# Altium project Project Sunsat PCB new.PrjPcb
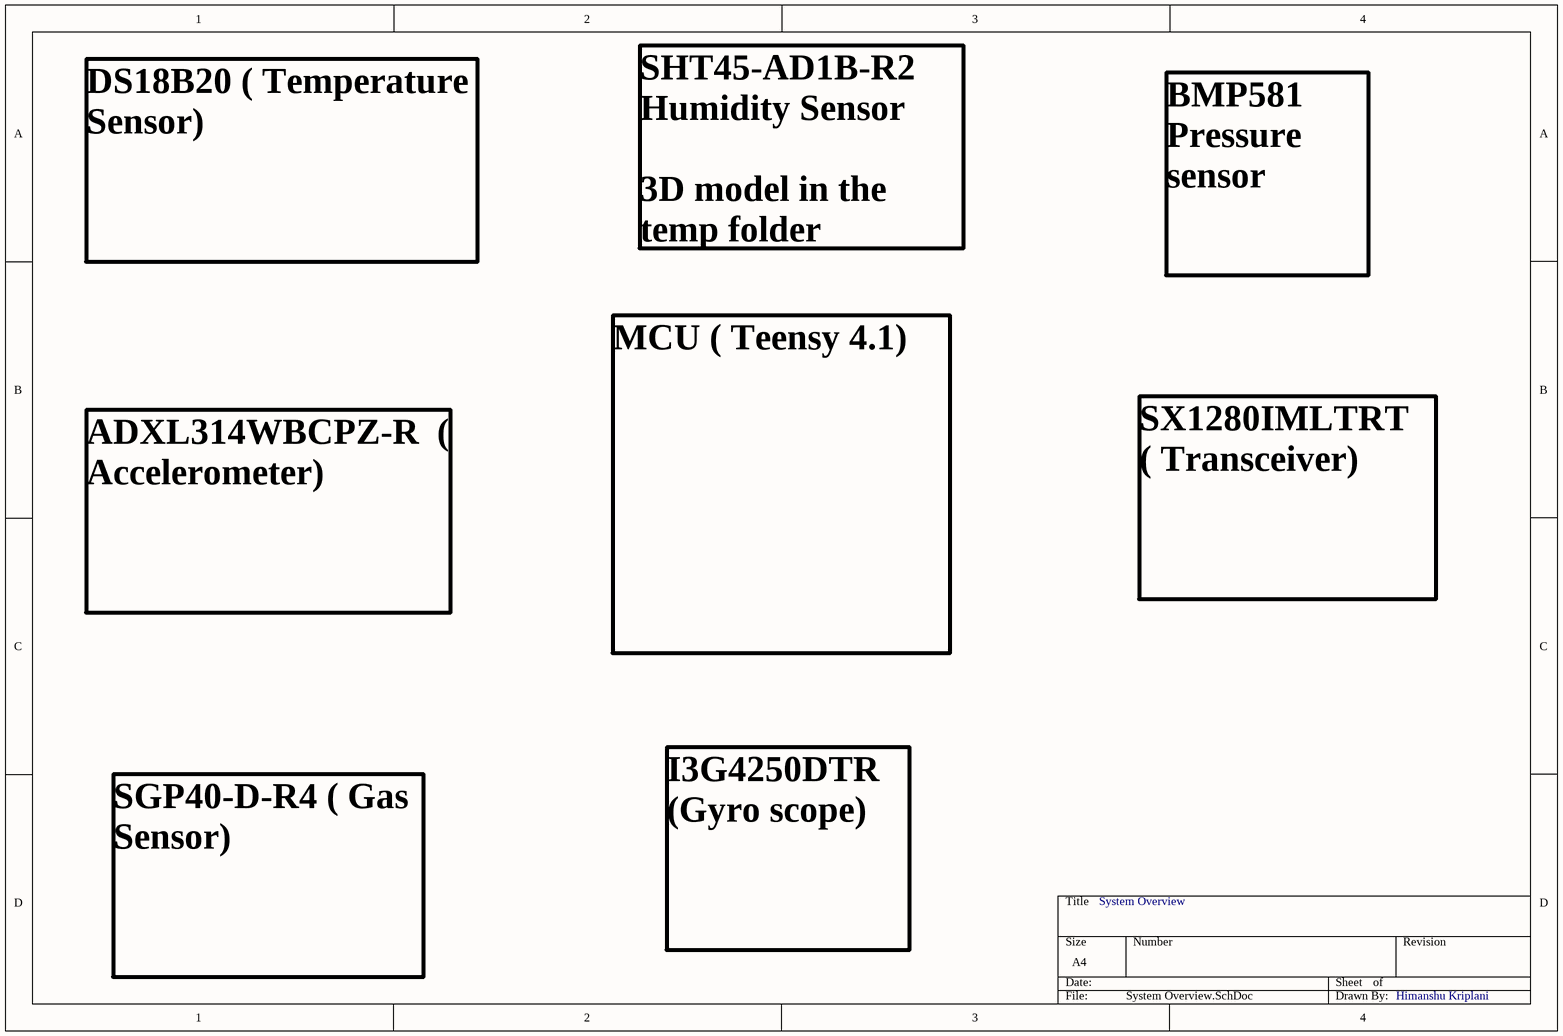
[diagram p0: System Overview.SchDoc]
4 sheets, 41 parts. Net scope: flat (ports and power ports of the same name join across sheets).
Board file: PCB1.PcbDoc
Sheets:
  System Overview.SchDoc
  Sensors schematic.SchDoc
  Sunsat Full Schematic.SchDoc
  Gyro Sensor.SchDoc

## Sheet System Overview.SchDoc
size A4; SheetNumber: 1; SheetTotal: 4

### Notes on the sheet
- SHT45-AD1B-R2
  Humidity Sensor
  3D model in the temp folder
- DS18B20 ( Temperature Sensor)
- BMP581 Pressure sensor
- ADXL314WBCPZ-R  ( Accelerometer)
- MCU ( Teensy 4.1)
- SX1280IMLTRT  ( Transceiver)
- System Overview
- SGP40-D-R4 ( Gas Sensor)
- I3G4250DTR  (Gyro scope)
- Himanshu Kriplani

## Sheet Sensors schematic.SchDoc
size A4; SheetNumber: 2; SheetTotal: 4
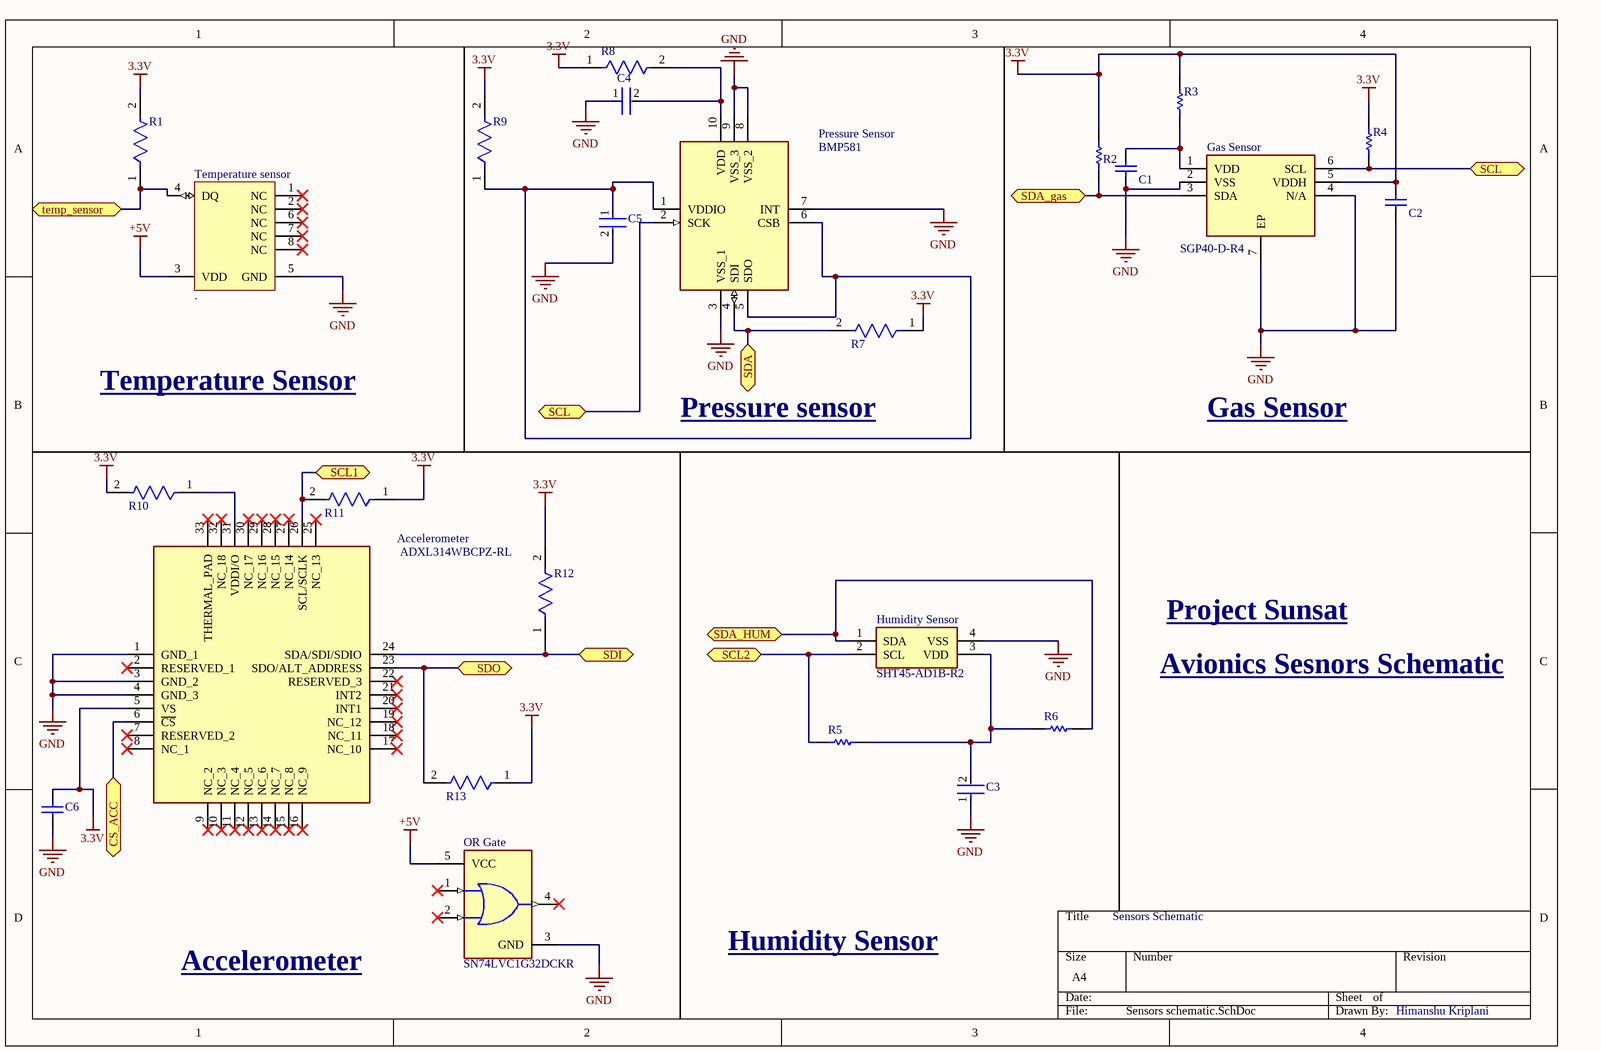
[diagram p1: Sensors schematic.SchDoc]

### Parts
Accelerometer  ADXL314WBCPZ-RL  [QFN50P500X500X155-33N-D]
C1  GRM21BR71H105KA12L  [CAPC2013X135X45LL10T25]  (value not drawn)
C2  GRM21BR71H105KA12L  [CAPC2013X135X45LL10T25]  (value not drawn)
C3  C1206C104K2RACTU  [FP-C1206C-EB-MFG]  (value not drawn)
C4  C1206C104K2RACTU  [FP-C1206C-EB-MFG]  (value not drawn)
C5  C1206C104K2RACTU  [FP-C1206C-EB-MFG]  (value not drawn)
C6  GRM188R71H104KA93D  [CAPC1608X90X35ML10T15]  (value not drawn)
Gas_Sensor  SGP40-D-R4  [SON80P244X244X95-7N]
Humidity_Sensor  SHT45-AD1B-R2  [SHT45AD1BR2]
OR_Gate  SN74LVC1G32DCKR  [FP-DCK0005A-IPC_A]
Pressure_Sensor  BMP581  [BMP581]
R1  CRCW06033K30FKEA  [FP-CRCW0603-e3-IPC_A]  (value not drawn)
R2  CRCW080510K0FKEAHP  [RESC2013X60X40NL15T20]  (value not drawn)
R3  ERJ-6RQF4R7V  [RESC2013X70X40LL20T20]  (value not drawn)
R4  CRCW080510K0FKEAHP  [RESC2013X60X40NL15T20]  (value not drawn)
R5  CRCW040210K0FKEDHP  [RESC1005X40X25ML05T10]  (value not drawn)
R6  CRCW040210K0FKEDHP  [RESC1005X40X25ML05T10]  (value not drawn)
R7  CRCW04024K70JNED  [FP-CRCW0402-e3-IPC_A]  (value not drawn)
R8  CRCW060310R0FKEA  [FP-CRCW0603-e3-IPC_A]  (value not drawn)
R9  CRCW060310R0FKEA  [FP-CRCW0603-e3-IPC_A]  (value not drawn)
R10  CRCW04024K70JNED  [FP-CRCW0402-e3-IPC_A]  (value not drawn)
R11  CRCW04024K70JNED  [FP-CRCW0402-e3-IPC_A]  (value not drawn)
R12  CRCW04024K70JNED  [FP-CRCW0402-e3-IPC_A]  (value not drawn)
R13  CRCW04024K70JNED  [FP-CRCW0402-e3-IPC_A]  (value not drawn)
Temperature_sensor  .  [MAXM-S8+2_L]

### Ports
CS_ACC (bidir, see Sunsat Full Schematic[1C]), SCL1 (bidir, see Sunsat Full Schematic[3C]), SCL2 (bidir, see Sunsat Full Schematic[3C]), SCL (bidir, see Sensors schematic[2B], Sunsat Full Schematic[1B]), SCL (bidir, see Sensors schematic[4A], Sunsat Full Schematic[1B]), SDA (bidir, see Sunsat Full Schematic[1C]), SDA_gas (bidir, see Sunsat Full Schematic[1C]), SDA_HUM (bidir, see Sunsat Full Schematic[3C]), SDI (bidir, see Sunsat Full Schematic[3C]), SDO (bidir, see Sunsat Full Schematic[3B]), temp_sensor (bidir, see Sunsat Full Schematic[3B])

### Nets
3.3V: Accelerometer.5(VS) C2.2 C6.2 Gas_Sensor.5(VDDH) R1.2 R2.2 R3.2 R4.2 R7.1 R8.1 R9.2 R10.2 R11.1 R12.2 R13.1
+5V: OR_Gate.5(VCC) Temperature_sensor.3(VDD)
GND: Accelerometer.1(GND_1) Accelerometer.3(GND_2) Accelerometer.4(GND_3) C1.1 C2.1 C3.1 C4.1 C5.2 C6.1 Gas_Sensor.2(VSS) Gas_Sensor.4(N/A) Gas_Sensor.7(EP) Humidity_Sensor.4(VSS) OR_Gate.3(GND) Pressure_Sensor.3(VSS_1) Pressure_Sensor.7(INT) Pressure_Sensor.8(VSS_2) Pressure_Sensor.9(VSS_3) Temperature_sensor.5(GND)
NetAccelerometer_6: Accelerometer.6(~{CS}) ; port CS_ACC
NetAccelerometer_23: Accelerometer.23(SDO/ALT_ADDRESS) R13.2 ; port SDO
NetAccelerometer_24: Accelerometer.24(SDA/SDI/SDIO) R12.1 ; port SDI
NetAccelerometer_26: Accelerometer.26(SCL/SCLK) R11.2 ; port SCL1
NetAccelerometer_31: Accelerometer.31(VDDI/O) R10.1
NetC1_2: C1.2 Gas_Sensor.1(VDD) R3.1
NetC3_2: C3.2 Humidity_Sensor.3(VDD) R5.2 R6.1
NetC4_2: C4.2 Pressure_Sensor.10(VDD) R8.2
NetC5_1: C5.1 Pressure_Sensor.1(VDDIO) Pressure_Sensor.5(SDO) Pressure_Sensor.6(CSB) R9.1
NetGas_Sensor_3: Gas_Sensor.3(SDA) R2.1 ; port SDA_gas
NetGas_Sensor_6: Gas_Sensor.6(SCL) Pressure_Sensor.2(SCK) R4.1 ; port SCL
NetHumidity_Sensor_1: Humidity_Sensor.1(SDA) R6.2 ; port SDA_HUM
NetHumidity_Sensor_2: Humidity_Sensor.2(SCL) R5.1 ; port SCL2
NetPressure_Sensor_4: Pressure_Sensor.4(SDI) R7.2 ; port SDA
NetR1_1: R1.1 Temperature_sensor.4(DQ) ; port temp_sensor

Not connected (* = marked no-connect by the designer): Accelerometer 2(RESERVED_1)* 7(RESERVED_2)* 8(NC_1)* 9(NC_2)* 10(NC_3)* 11(NC_4)* 12(NC_5)* 13(NC_6)* 14(NC_7)* 15(NC_8)* 16(NC_9)* 17(NC_10)* 18(NC_11)* 19(NC_12)* 20(INT1)* 21(INT2)* 22(RESERVED_3)* 25(NC_13)* 27(NC_14)* 28(NC_15)* 29(NC_16)* 30(NC_17)* 32(NC_18)* 33(THERMAL_PAD)*; OR_Gate 1(A)* 2(B)* 4(Y)*; Temperature_sensor 1(NC)* 2(NC)* 6(NC)* 7(NC)* 8(NC)*

### Notes on the sheet
- Temperature Sensor
- Pressure sensor
- Gas Sensor
- Project Sunsat
- Avionics Sesnors Schematic
- Sensors Schematic
- Accelerometer
- Humidity Sensor
- Himanshu Kriplani

### Library data of the parts
Accelerometer = CMP-016-000000-1: Accelerometers Hi-G low power XL for CbM; Manufacturer_Name: Analog Devices; Geometry.Height: 1.55mm; Datasheet Link: https://www.analog.com/media/en/technical-documentation/data-sheets/adxl314.pdf; Mouser Price/Stock: https://www.mouser.co.uk/ProductDetail/Analog-Devices/ADXL314WBCPZ-RL?qs=4ASt3YYao0VqiVnUWLAbOQ%3D%3D; Source: ADXL314WBCPZ-RL.SchLib; Manufacturer_Part_Number: ADXL314WBCPZ-RL; Design Item ID: ADXL314WBCPZ-RL; Mouser Part Number: 584-ADXL314WBCPZ-RL
C1 = CMP-1036-04761-2: 1uF capacitor; Manufacturer: Murata; Part Number: GRM21BR71H105KA12L
C2 = CMP-1036-04761-2: 1uF  Capacitor; Manufacturer: Murata; Part Number: GRM21BR71H105KA12L
C3-C5 = CMP-1037-04222-2: CAP CER 0.1UF 200V 10% X7R 1206; Manufacturer: KEMET; Automotive Grade: Grade 0; Tolerance: 0.1; Value: 0.10 μF; Material: Ceramic; Temperature Coefficient: 15%; Automotive: Yes; Temperature Characteristic: X7R; Digikey Description: CAP CER 0.1UF 200V 10% X7R 1206; ComponentLink2URL: https://content.kemet.com/datasheets/KEM_C1007_X8R_ULTRA_150C_SMD.pdf; Voltage Rating: 200 V; Manufacturer Part Number: C1206C104K2RACTU; Temperature Range High: +150°C; Device Class L1: Passive Components; Octopart: https://octopart.com/c1206c104k2ractu-kemet-9138344; Temperature: -55°C to +150°C; Height: 0.88mm; Device Class L3: Ceramic Capacitors; Lead Free: Yes; Package: C1206C-EB; Category: Cap; Temperature Range Low: -55°C; Mouser Description: Multilayer Ceramic Capacitors MLCC - SMD/SMT 200volts 0.1uF X7R 10%; Ipc Land Pattern Name: CAPC320160X78; Capacitance: 0.10 μF; RoHS: TRUE; ComponentLink2Description: Datasheet; Device Class L2: Capacitors
C6 = CMP-2100-03643-1: Chip Capacitor, 0.1 uF, +/- 10%, 50 V, -55 to 125 degC, 0603 (1608 Metric), RoHS, Tape and Reel; Manufacturer: Murata; Dielectric Material: Ceramic; Voltage Rating: 50V; Capacitance: 100nF; Dielectric: X7R; Insulation Resistance: 10GR; Case Code (Metric): 1608; Lead Free: LeadFree; Depth: 0.8mm; Number of Pins: 2; Radiation Hardening: No; Case/Package: 0603; Manufacturer URL: http://www.murata.com/; Packaging: TapeandReel; Length: 1.6mm; Contact Plating: Tin; Datasheet URL: http://psearch.en.murata.com/capacitor/product/GRM188R71H104KA93%23.pdf; Tolerance: 10%; Case Code (Imperial): 0603; Min Operating Temperature: -55degC; RoHSCompliant: true; Voltage: 50V; Termination: SMD/SMT; Mount: SurfaceMount; Material: Ceramic; Package Quantity: 1; Height: 0.8mm; Thickness: 0.035inch; REACH SVHC: NoSVHC; Max Operating Temperature: 125degC; Width: 0.8mm; Package Reference: 0603; Voltage Rating (DC): 50V; Datasheet Version: 42675.0; Package Description: 2-Pin Surface Mount Device, Body 1.6 x 0.8 mm
Gas_Sensor = CMP-013-000000-1: Air Quality Sensors Gas Sensor 2.5k pcs IC; Manufacturer_Name: Sensirion; Geometry.Height: 0.95mm; Mouser Price/Stock: https://www.mouser.co.uk/ProductDetail/Sensirion/SGP40-D-R4?qs=yqaQSyyJnNgaRqiZfsbS1Q%3D%3D; Design Item ID: SGP40-D-R4; Mouser Part Number: 403-SGP40-D-R4; Source: SGP40-D-R4.SchLib; Manufacturer_Part_Number: SGP40-D-R4; Datasheet Link: https://www.mouser.co.uk/datasheet/2/682/Sensirion_Gas_Sensors_Datasheet_SGP40-3135293.pdf
Humidity_Sensor = CMP-019-000000-1: 4 4th Generation, High-Accuracy, Ultra-Low-Power, 16-bit Relative Humidity and Temperature Sensor; Manufacturer_Name: Sensirion; Geometry.Height: 0.59mm; Mouser Price/Stock: https://www.mouser.co.uk/ProductDetail/Sensirion/SHT45-AD1B-R2?qs=Znm5pLBrcAImXcmTJwn%2FTg%3D%3D; Source: SHT45-AD1B-R2.SchLib; Datasheet Link: https://www.mouser.de/datasheet/2/682/Datasheet_SHT4x-2936319.pdf; Manufacturer_Part_Number: SHT45-AD1B-R2; Mouser Part Number: 403-SHT45-AD1B-R2; Design Item ID: SHT45-AD1B-R2
OR_Gate = CMP-0859-00376-4: IC GATE OR 1CH 2-INP SC70-5; Turn-On Delay Time: 4.5ns; Schmitt Trigger Input: No; Number of Bits: 1; High Level Output Current: -32mA; Max Supply Voltage: 5.5V; Propagation Delay: 4ns; Max Output Current: 32mA; Min Supply Voltage: 1.65V; Number of Input Lines: 2; Quiescent Current: 10uA; Case/Package: SC; Weight: 8.8E-05oz; Logic Function: OR; Package Quantity: 1; Packaging: Tape and Reel; Mount: Surface Mount; Max Operating Temperature: 125°C; Output Current: 32mA; Length: 2mm; Contact Plating: Gold; Number of Output Lines: 1; Height: 0.9mm; Number of Pins: 5; Width: 1.25mm; REACH SVHC: No SVHC; Number of Circuits: 1; Radiation Hardening: No; Number of Elements: 1; Low Level Output Current: 32mA; Number of Outputs: 1; Min Operating Temperature: -40°C; Number of Inputs: 2; Lead Free: Lead Free; Termination: SMD/SMT; Number of Gates: 1
Pressure_Sensor = CMP-010-000000-1: Pressure Sensor 4.35PSI ~ 18.13PSI (30kPa ~ 125kPa) Absolute 10-WFLGA; Manufacturer_Name: BOSCH; Geometry.Height: 0.8mm; Datasheet Link: https://www.bosch-sensortec.com/media/boschsensortec/downloads/datasheets/bst-bmp581-ds004.pdf; Manufacturer_Part_Number: BMP581; Mouser Price/Stock: https://www.mouser.co.uk/ProductDetail/Bosch-Sensortec/BMP581?qs=Li%252BoUPsLEntPL9tlFmcgXg%3D%3D; Design Item ID: BMP581; Mouser Part Number: 262-BMP581; Source: BMP581.SchLib
R1 = CMP-2100-03614-2: RES Thick Film, 3.3kΩ, 1%, 0.1W, 100ppm/°C, 0603; Resistance: 3.3kR; Power Rating: 100mW; Voltage Rating (DC): 75V; Height: 0.45mm; Lead Free: Lead Free; Min Operating Temperature: -55°C; Number of Terminations: 2; Mount: Surface Mount; Max Operating Temperature: 155°C; Package Quantity: 10; Radiation Hardening: No; Features: Automotive AEC-Q200; Depth: 0.85mm; Case Code (Metric): 1608; Termination: SMD/SMT; Width: 0.85mm; Length: 1.55mm; Case Code (Imperial): 0603; Contact Plating: Tin; Temperature Coefficient: 100ppm/°C; Weight: 7.1E-05oz; Packaging: Tape and Reel; Tolerance: 1%; Military Standard: Not; Case/Package: 0603; Working Voltage: 75V; Max Power Dissipation: 100mW; Voltage Rating: 75V; Composition: Thick Film
R2 R4 = CMP-2001-04472-1: 10k resistor; Manufacturer: Vishay Dale; Part Number: CRCW080510K0FKEAHP
R3 = CMP-1665-00033-1: Chip Resistor, 4.7 Ohm, +/- 1%, 125 mW, -55 to 125 degC, 0805 (2012 Metric), RoHS, Tape and Reel; Power Rating: 125 mW; Case\/Package: 0805; Resistance: 4.7 Ohm; Mount: Surface Mount; Length: 0.079 inch; Tolerance: 1%; REACH SVHC: No SVHC; PackageDescription: 2-Pin Surface Mount Device, Body 2 x 1.5 mm; ComponentLink1URL: http://www.panasonic.com/; Width: 0.049 inch; Min Operating Temperature: -55 degC; Height: 0.028 inch; Case Code (Metric): 2012; Mounting Technology: Surface Mount; Pins: 2; PartNumber: ERJ-6RQF4R7V; Max Operating Temperature: 125 degC; Packaging: Tape and Reel; ComponentLink2URL: http://industrial.panasonic.com/cdbs/www-data/pdf/RDA0000/AOA0000C86.pdf; RoHSCompliant: true; ComponentLink2Description: Datasheet; PackageReference: 0805; Package Quantity: 5000; ComponentLink1Description: Manufacturer URL; Radiation Hardening: No; Case Code (Imperial): 0805; DatasheetVersion: 04/2015
R5 R6 = CMP-2002-03043-1: 10 K ohm resistor; Manufacturer: Vishay Dale; Part Number: CRCW040210K0FKEDHP
R7 R10-R13 = CMP-2002-00052-3: RES Thick Film, 4.7kΩ, 5%, 0.063W, 200ppm/°C, 0402; Power Rating: 63mW; Resistance: 4.7kR; Voltage Rating: 50V; Case Code (Metric): 1005; Case/Package: 0402; Composition: Thick Film; Depth: 0.5mm; Min Operating Temperature: -55°C; Temperature Coefficient: 200ppm/°C; Max Power Dissipation: 63mW; Packaging: Tape and Reel; Max Operating Temperature: 155°C; Number of Terminations: 2; Width: 0.5mm; Height: 0.35mm; Contact Plating: Tin; Package Quantity: 1; Length: 1mm; Termination: SMD/SMT; Radiation Hardening: No; Weight: 2.3E-05oz; Military Standard: Not; Case Code (Imperial): 0402; Features: Automotive AEC-Q200; Tolerance: 5%
R8 R9 = CMP-2000-03845-2: RES Thick Film, 10Ω, 1%, 0.1W, 100ppm/°C, 0603; Resistance: 10R; Voltage Rating (DC): 75V; Power Rating: 100mW; Depth: 0.85mm; Height: 0.45mm; Package Quantity: 10; Temperature Coefficient: 100ppm/°C; Weight: 7.1E-05oz; Case Code (Metric): 1608; Number of Terminations: 2; Features: Automotive AEC-Q200; Termination: SMD/SMT; Lead Free: Lead Free; Mount: Surface Mount; Number of Pins: 2; Tolerance: 1%; Max Power Dissipation: 100mW; Width: 0.033inch; Contact Plating: Tin; Case Code (Imperial): 0603; Max Operating Temperature: 155°C; Min Operating Temperature: -55°C; Voltage Rating: 75V; Length: 1.55mm; Case/Package: 0603; Composition: Thick Film; Packaging: Tape and Reel; Military Standard: Not
Temperature_sensor = CMP-0253-00019-2: High-Precision 1-Wire Digital Thermometer, -55 to 125 degC, 8-Pin SOIC (S8+2), Pb-Free; PartNumber: DS18B20Z+; Generic Part Number: DS18B20; Sensor Type: Local; Temp. Thresh.: Programmable (NV); Parasite Pwr.: Yes; ComponentLink1Description: Manufacturer URL; Mounting Technology: Surface Mount; ComponentLink2URL: http://datasheets.maximintegrated.com/en/ds/DS18B20.pdf; Code_JEDEC: MS012; ComponentLink2Description: Datasheet; DatasheetVersion: Rev. 4; PackageVersion: Rev. D, 10/2012; ComponentLink1URL: http://www.maximintegrated.com/; PackageReference: S8+2; ComponentLink3URL: http://pdfserv.maximintegrated.com/package_dwgs/21-0041.PDF; Interface: 1-Wire; ComponentLink3Description: Package Specification; RoHS: Pb-Free; Multi Droppable: Yes; PackageDescription: 8-Pin Small-Outline IC, Narrow (0.15in) (S8+2), Body 4.90 x 3.90 mm, Pitch 1.27 mm

## Sheet Sunsat Full Schematic.SchDoc
size A4; SheetNumber: 3; SheetTotal: 4
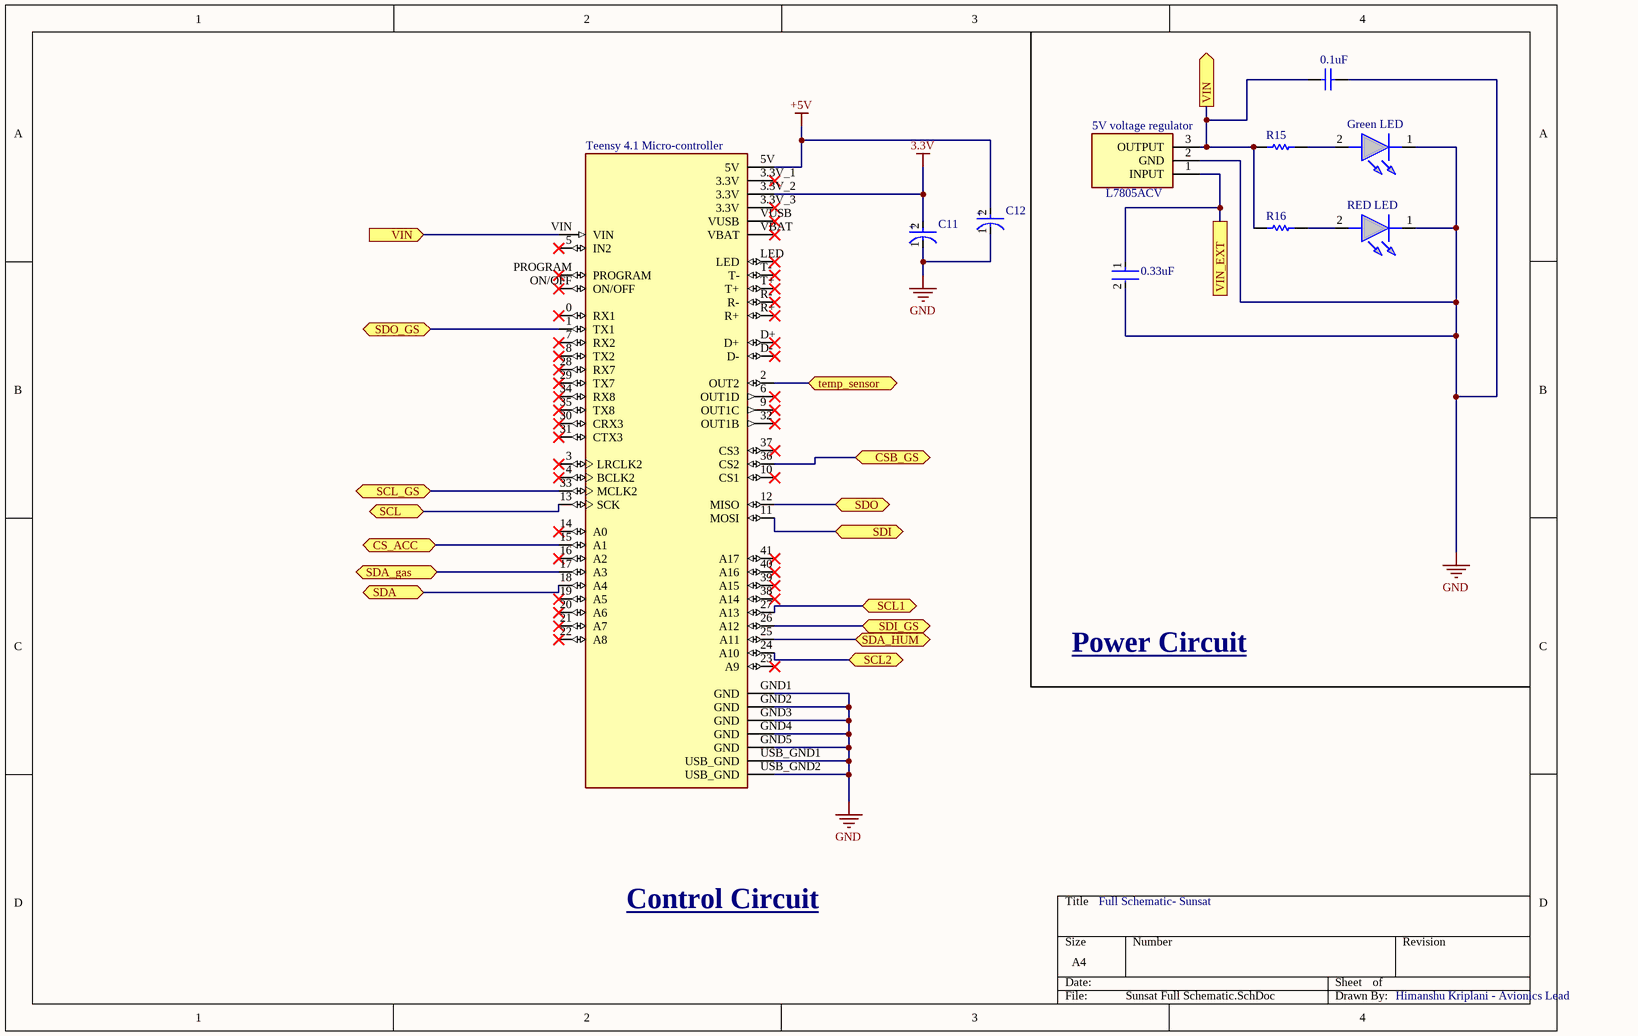
[diagram p2: Sunsat Full Schematic.SchDoc]

### Parts
0.1uF  GRM188R71H104KA93D  [CAPC1608X90X35ML10T15]  (value not drawn)
0.33uF  C2012X8R1E334K125AA  [FP-C2012-125-0_2-IPC_B]  (value not drawn)
5V_voltage_regulator  L7805ACV  [TO255P460X1020X2008-3P]
C11  293D105X0016A2TE3  [FP-293DA-MFG]  (value not drawn)
C12  293D105X0016A2TE3  [FP-293DA-MFG]  (value not drawn)
Green_LED  ASCKCG00-NW5X5020302  [ASCKCG00NW5X5020302]  (value not drawn)
R15  CRCW0603110RFKEA  [RESC1609X50X30NL10T20]  (value not drawn)
R16  CRCW0603110RFKEA  [RESC1609X50X30NL10T20]  (value not drawn)
RED_LED  ASCKCR00-BU5V5020402  [ASCKCR00BU5V5020402]  (value not drawn)
Teensy_4.1_Micro-controller  Teensy 4.1  [MODULE_DEV-16771]  (value not drawn)

### Ports
CS_ACC (bidir, see Sensors schematic[1D]), CSB_GS (bidir, see Gyro Sensor[2C]), SCL1 (bidir, see Sensors schematic[1B]), SCL2 (bidir, see Sensors schematic[2C]), SCL (bidir, see Sensors schematic[2B], Sensors schematic[4A]), SCL_GS (bidir, see Gyro Sensor[2B]), SDA (bidir, see Sensors schematic[2B]), SDA_gas (bidir, see Sensors schematic[3A]), SDA_HUM (bidir, see Sensors schematic[2C]), SDI (bidir, see Sensors schematic[2C]), SDI_GS (bidir, see Gyro Sensor[2B]), SDO (bidir, see Sensors schematic[2C]), SDO_GS (bidir, see Gyro Sensor[2B]), temp_sensor (bidir, see Sensors schematic[1A]), VIN (in, see Sunsat Full Schematic[4A]), VIN (out, see Sunsat Full Schematic[1A]), VIN_EXT (see Sunsat Full Schematic[4B])

### Nets
3.3V: C11.2(A) Teensy_4.1_Micro-controller.3.3V_2(3.3V)
+5V: C12.2(A) Teensy_4.1_Micro-controller.5V
GND: 0.1uF.2 0.33uF.2 5V_voltage_regulator.2(GND) C11.1(C) C12.1(C) Green_LED.1(K) RED_LED.1(K) Teensy_4.1_Micro-controller.GND1(GND) Teensy_4.1_Micro-controller.GND2(GND) Teensy_4.1_Micro-controller.GND3(GND) Teensy_4.1_Micro-controller.GND4(GND) Teensy_4.1_Micro-controller.GND5(GND) Teensy_4.1_Micro-controller.USB_GND1(USB_GND) Teensy_4.1_Micro-controller.USB_GND2(USB_GND)
Net0.1uF_1: 0.1uF.1 5V_voltage_regulator.3(OUTPUT) R15.1 R16.1 Teensy_4.1_Micro-controller.VIN ; port VIN
Net0.33uF_1: 0.33uF.1 5V_voltage_regulator.1(INPUT) ; port VIN_EXT
NetAccelerometer_6: Teensy_4.1_Micro-controller.15(A1) ; port CS_ACC
NetAccelerometer_23: Teensy_4.1_Micro-controller.12(MISO) ; port SDO
NetAccelerometer_24: Teensy_4.1_Micro-controller.11(MOSI) ; port SDI
NetAccelerometer_26: Teensy_4.1_Micro-controller.27(A13) ; port SCL1
NetGas_Sensor_3: Teensy_4.1_Micro-controller.17(A3) ; port SDA_gas
NetGas_Sensor_6: Teensy_4.1_Micro-controller.13(SCK) ; port SCL
NetGreen_LED_2: Green_LED.2(A) R15.2
NetGyro_Sensor_2: Teensy_4.1_Micro-controller.33(MCLK2) ; port SCL_GS
NetGyro_Sensor_3: Teensy_4.1_Micro-controller.26(A12) ; port SDI_GS
NetGyro_Sensor_4: Teensy_4.1_Micro-controller.1(TX1) ; port SDO_GS
NetGyro_Sensor_5: Teensy_4.1_Micro-controller.36(CS2) ; port CSB_GS
NetHumidity_Sensor_1: Teensy_4.1_Micro-controller.25(A11) ; port SDA_HUM
NetHumidity_Sensor_2: Teensy_4.1_Micro-controller.24(A10) ; port SCL2
NetPressure_Sensor_4: Teensy_4.1_Micro-controller.18(A4) ; port SDA
NetR1_1: Teensy_4.1_Micro-controller.2(OUT2) ; port temp_sensor
NetR16_2: R16.2 RED_LED.2(A)

Not connected (* = marked no-connect by the designer): Teensy_4.1_Micro-controller 0(RX1)* 3(LRCLK2)* 3.3V_1(3.3V)* 3.3V_3(3.3V)* 4(BCLK2)* 5(IN2)* 6(OUT1D)* 7(RX2)* 8(TX2)* 9(OUT1C)* 10(CS1)* 14(A0)* 16(A2)* 19(A5)* 20(A6)* 21(A7)* 22(A8)* 23(A9)* 28(RX7)* 29(TX7)* 30(CRX3)* 31(CTX3)* 32(OUT1B)* 34(RX8)* 35(TX8)* 37(CS3)* 38(A14)* 39(A15)* 40(A16)* 41(A17)* D+* D-* LED* ON/OFF* PROGRAM* R+* R-* T+* T-* VBAT* VUSB*

### Notes on the sheet
- Power Circuit
- Control Circuit
- Full Schematic- Sunsat
- Himanshu Kriplani - Avionics Lead
- (in symbol CMP-00030-40940187-1) +

### Library data of the parts
0.1uF = CMP-2100-03643-1: as C6 on sheet Sensors schematic; Case Code (Metric): 1608; Lead Free: LeadFree; Depth: 0.8mm; Number of Pins: 2; Radiation Hardening: No; Case/Package: 0603; Manufacturer URL: http://www.murata.com/; Packaging: TapeandReel; Length: 1.6mm; Contact Plating: Tin; Datasheet URL: http://psearch.en.murata.com/capacitor/product/GRM188R71H104KA93%23.pdf; Tolerance: 10%; Case Code (Imperial): 0603; Min Operating Temperature: -55degC; RoHSCompliant: true; Voltage: 50V; Termination: SMD/SMT; Mount: SurfaceMount; Material: Ceramic; Package Quantity: 1; Height: 0.8mm; Thickness: 0.035inch; REACH SVHC: NoSVHC; Max Operating Temperature: 125degC; Width: 0.8mm; Package Reference: 0603; Voltage Rating (DC): 50V; Datasheet Version: 42675.0; Package Description: 2-Pin Surface Mount Device, Body 1.6 x 0.8 mm
0.33uF = CMP-08246-004363-1: Multilayer Ceramic Capacitors 330nF ±10% 25V X8R SMD 0805; Mount: Surface Mount; Termination: SMD/SMT; Max Operating Temperature: 150°C; Voltage Rating (DC): 25V; Voltage Rating: 25V; Min Operating Temperature: -55°C; Case/Package: 0805; Packaging: Tape and Reel; Width: 0.049inch; Dielectric: X8R; Depth: 1.25mm; Case Code (Imperial): 0805; Capacitance: 330nF; Thickness: 0.057inch; RoHS Compliant: Yes; Features: High Temperature; Resistor Type: Ceramic; Series: C; Height: 1.25mm; Number of Pins: 2; Package Quantity: 1; REACH SVHC: No SVHC; Length: 2mm; Weight: 0.000194oz; Tolerance: 10%; Case Code (Metric): 2012
5V_voltage_regulator = CMP-028-000000-1: Linear voltage regulator,L7805ACV 5V 1A STMicroelectronics L7805ACV, Single Linear Voltage Regulator, 1A 5 V, 2%, 3-Pin TO-220; Geometry.Height: 4.6mm; Manufacturer_Name: STMicroelectronics; Mouser Part Number: 511-L7805ACV; Mouser Price/Stock: https://www.mouser.co.uk/ProductDetail/STMicroelectronics/L7805ACV?qs=xv3lWMc77RdYd2PeLwOwYw%3D%3D; Manufacturer_Part_Number: L7805ACV; Design Item ID: L7805ACV; Datasheet Link: http://www.st.com/web/en/resource/technical/document/datasheet/CD00000444.pdf; Source: L7805ACV.SchLib
C11 C12 = CMP-00030-40940187-1: 293D105X0016A2TE3 Surface Mount Tantalum Capacitor, 1 uF, 16 V, ± 20%, -55 °C, 125 °C, 1206 [3216-18 Metric]; Ripple Current: 90mA; Capacitance: 1µF; Leakage Current: 500nA; Polarity: Polar; Voltage Rating (DC): 16V; Dissipation Factor: 4%; ESR (Equivalent Series Resistance): 9.3Ω; Case Code (Imperial): 1206; Case/Package: 1206; Schedule B: 8532210050, 8532210050; Height: 1.8mm; Mount: PCB, Surface Mount; Height - Seated (Max): 1.8034mm; Min Operating Temperature: -55°C; Max Operating Temperature: 125°C; Dielectric Material: Tantalum; Packaging: Tape and Reel; Radiation Hardening: No; Lead Free: Lead Free; Features: General Purpose; REACH SVHC: Unknown; Width: 1.6002mm; RoHS: Compliant; Tolerance: 20%; Termination: SMD/SMT; Length: 3.2mm; Depth: 1.6mm; Number of Pins: 2; Voltage Rating: 16V; NexarPartId: 40940187; Case Code (Metric): 3216
Green_LED = CMP-004-00031-1: Green 524nm LED Indication - Discrete 3.3V 0603 (1608 Metric); Manufacturer_Name: Avago Technologies; Geometry.Height: 0.75mm; Mouser Price/Stock: https://www.mouser.co.uk/ProductDetail/Broadcom-Avago/ASCKCG00-NW5X5020302?qs=OcgtsXO%252B3gsRJ%252BJUmBwdbA%3D%3D; Manufacturer_Part_Number: ASCKCG00-NW5X5020302; Source: ASCKCG00-NW5X5020302.SchLib; Design Item ID: ASCKCG00-NW5X5020302; Datasheet Link: https://docs.broadcom.com/doc/ASCKCx00-xxxxx0x0x02-DS; Mouser Part Number: 630-ASCKCG00NW5X5020
R15 R16 = CMP-2000-03854-1: Manufacturer: Vishay Dale; Part Number: CRCW0603110RFKEA
RED_LED = CMP-004-00032-1: Red 622nm LED Indication - Discrete 2.1V 0603 (1608 Metric); Manufacturer_Name: Avago Technologies; Geometry.Height: 0.75mm; Mouser Part Number: 630-ASCKCR00BU5V5020; Mouser Price/Stock: https://www.mouser.co.uk/ProductDetail/Broadcom-Avago/ASCKCR00-BU5V5020402?qs=OcgtsXO%252B3gu355%2FiA8jcWA%3D%3D; Source: ASCKCR00-BU5V5020402.SchLib; Datasheet Link: https://docs.broadcom.com/doc/ASCKCx00-xxxxx0x0x02-DS; Manufacturer_Part_Number: ASCKCR00-BU5V5020402; Design Item ID: ASCKCR00-BU5V5020402
Teensy_4.1_Micro-controller = CMP-003-000000-1: RT1062 Teensy 4.1 series ARMÂ® CortexÂ®-M7 MPU Embedded Evaluation Board; MF: SparkFun Electronics; MP: DEV-16771; Package: None; Component Type: Standard; Pin Count: 65; Purchase-URL: https://pricing.snapeda.com/search/part/DEV-16771/?ref=eda; SnapEDA_Link: https://www.snapeda.com/parts/DEV-16771/SparkFun+Electronics/view-part/?ref=snap; Availability: In Stock; Source: DEV-16771.SchLib; Design Item ID: DEV-16771; Check_prices: https://www.snapeda.com/parts/DEV-16771/SparkFun+Electronics/view-part/?ref=eda; Value: *; Price: None

## Sheet Gyro Sensor.SchDoc
size A; SheetNumber: 4; SheetTotal: 4
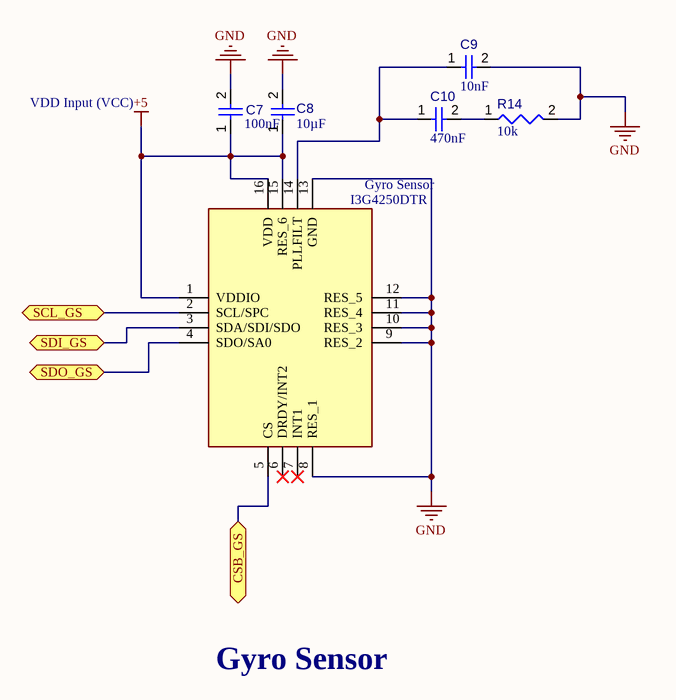
[diagram p3: Gyro Sensor.SchDoc]

### Parts
C7  value 100nF  [CAPC0402(1005)60_L]  (hidden comment: Capacitor 100nF +/-20% 10V 0402)
C8  value 10µF  [CAPC0402(1005)60_L]  (hidden comment: Capacitor 10µF +/-40% 6.3V 0402)
C9  value 10nF  [CAPC0402(1005)60_L]  (hidden comment: Capacitor 10nF +/-20% 50V 0402)
C10  value 470nF  [CAPC0603(1608)100_L]  (hidden comment: Capacitor 470nF +/-20% 25V 0603)
Gyro_Sensor  I3G4250DTR  [LGA-16L(4X4X1.1MM)]
R14  value 10k  [RESC3216X60X45ML15T20]  (hidden comment: Resistor 10k +/-1% 1206 250 mW)

### Ports
CSB_GS (bidir, see Sunsat Full Schematic[3B]), SCL_GS (bidir, see Sunsat Full Schematic[1B]), SDI_GS (bidir, see Sunsat Full Schematic[3C]), SDO_GS (bidir, see Sunsat Full Schematic[1B])

### Nets
+5: C7.1 C8.1 Gyro_Sensor.1(VDDIO) Gyro_Sensor.15(RES_6) Gyro_Sensor.16(VDD)
GND: C7.2 C8.2 C9.2 Gyro_Sensor.8(RES_1) Gyro_Sensor.9(RES_2) Gyro_Sensor.10(RES_3) Gyro_Sensor.11(RES_4) Gyro_Sensor.12(RES_5) Gyro_Sensor.13(GND) R14.2
NetC9_1: C9.1 C10.1 Gyro_Sensor.14(PLLFILT)
NetC10_2: C10.2 R14.1
NetGyro_Sensor_2: Gyro_Sensor.2(SCL/SPC) ; port SCL_GS
NetGyro_Sensor_3: Gyro_Sensor.3(SDA/SDI/SDO) ; port SDI_GS
NetGyro_Sensor_4: Gyro_Sensor.4(SDO/SA0) ; port SDO_GS
NetGyro_Sensor_5: Gyro_Sensor.5(CS) ; port CSB_GS

Not connected (* = marked no-connect by the designer): Gyro_Sensor 6(DRDY/INT2)* 7(INT1)*

### Notes on the sheet
- VDD Input (VCC)
- Gyro Sensor

### Library data of the parts
C7 = CMP-001-00061-3: Chip Capacitor, 100nF +/-20%, 10V, 0402, Thickness 0.6 mm; Tolerance: 20%; Mounting Technology: SMT; Voltage Rating: 10V; Max Operating Temperature: 85°C; Pins: 2; Case/Package: 0402; Min Operating Temperature: -55°C
C8 = CMP-001-00074-3: Chip Capacitor, 10µF +/-40%, 6.3V, 0402, Thickness 0.6 mm; Tolerance: 10%; Case/Package: 0402; Pins: 2; Mounting Technology: SMT; Voltage Rating: 6.3V; Max Operating Temperature: 85°C; Min Operating Temperature: -55°C
C9 = CMP-001-00069-3: Chip Capacitor, 10nF +/-20%, 50V, 0402, Thickness 0.6 mm; Tolerance: 5%; Max Operating Temperature: 85°C; Pins: 2; Case/Package: 0402; Voltage Rating: 50V; Min Operating Temperature: -55°C; Mounting Technology: SMT
C10 = CMP-001-00077-3: Chip Capacitor, 470nF +/-20%, 25V, 0603, Thickness 1 mm; Tolerance: 10%; Max Operating Temperature: 85°C; Voltage Rating: 25V; Pins: 2; Case/Package: 0603; Mounting Technology: SMT; Min Operating Temperature: -55°C
Gyro_Sensor = I3G4250DTR: Integrated Circuit; Manufacturer_Name: STMicroelectronics; Datasheet Link: http://www.st.com/content/ccc/resource/technical/document/datasheet/e4/b1/d1/62/1a/e6/44/2f/DM00168691.pdf/files/DM00168691.pdf/jcr:content/translations/en.DM00168691.pdf; Manufacturer_Part_Number: I3G4250DTR; Mouser Part Number: 511-I3G4250DTR; Mouser Price/Stock: https://www.mouser.co.uk/ProductDetail/STMicroelectronics/I3G4250DTR?qs=v3MacVxtdDJPIS9io4RmPA%3D%3D; Arrow Part Number: I3G4250DTR; Arrow Price/Stock: https://www.arrow.com/en/products/i3g4250dtr/stmicroelectronics
R14 = CMP-009-00016-5: Chip Resistor, 10 KOhm, +/- 1%, 0.25 W, -55 to 155 degC, 1206 (3216 Metric); Power: 250mW; Voltage Rating: 200V; Pins: 2; Max Operating Temperature: 155°C; Tolerance: 1%; RoHS Compliant: True; Case/Package: 1206; Min Operating Temperature: -55°C; Mounting Technology: SM

## Nets that join several sheets
3.3V: Sensors schematic (15 pins), Sunsat Full Schematic (C11.2 Teensy_4.1_Micro-controller.3.3V_2)
+5V: Sensors schematic (OR_Gate.5 Temperature_sensor.3), Sunsat Full Schematic (C12.2 Teensy_4.1_Micro-controller.5V)
GND: Sensors schematic (19 pins), Sunsat Full Schematic (14 pins), Gyro Sensor (10 pins)
NetAccelerometer_6: Sensors schematic (Accelerometer.6), Sunsat Full Schematic (Teensy_4.1_Micro-controller.15)
NetAccelerometer_23: Sensors schematic (Accelerometer.23 R13.2), Sunsat Full Schematic (Teensy_4.1_Micro-controller.12)
NetAccelerometer_24: Sensors schematic (Accelerometer.24 R12.1), Sunsat Full Schematic (Teensy_4.1_Micro-controller.11)
NetAccelerometer_26: Sensors schematic (Accelerometer.26 R11.2), Sunsat Full Schematic (Teensy_4.1_Micro-controller.27)
NetGas_Sensor_3: Sensors schematic (Gas_Sensor.3 R2.1), Sunsat Full Schematic (Teensy_4.1_Micro-controller.17)
NetGas_Sensor_6: Sensors schematic (Gas_Sensor.6 Pressure_Sensor.2 R4.1), Sunsat Full Schematic (Teensy_4.1_Micro-controller.13)
NetGyro_Sensor_2: Sunsat Full Schematic (Teensy_4.1_Micro-controller.33), Gyro Sensor (Gyro_Sensor.2)
NetGyro_Sensor_3: Sunsat Full Schematic (Teensy_4.1_Micro-controller.26), Gyro Sensor (Gyro_Sensor.3)
NetGyro_Sensor_4: Sunsat Full Schematic (Teensy_4.1_Micro-controller.1), Gyro Sensor (Gyro_Sensor.4)
NetGyro_Sensor_5: Sunsat Full Schematic (Teensy_4.1_Micro-controller.36), Gyro Sensor (Gyro_Sensor.5)
NetHumidity_Sensor_1: Sensors schematic (Humidity_Sensor.1 R6.2), Sunsat Full Schematic (Teensy_4.1_Micro-controller.25)
NetHumidity_Sensor_2: Sensors schematic (Humidity_Sensor.2 R5.1), Sunsat Full Schematic (Teensy_4.1_Micro-controller.24)
NetPressure_Sensor_4: Sensors schematic (Pressure_Sensor.4 R7.2), Sunsat Full Schematic (Teensy_4.1_Micro-controller.18)
NetR1_1: Sensors schematic (R1.1 Temperature_sensor.4), Sunsat Full Schematic (Teensy_4.1_Micro-controller.2)